# EAGLE design WemosD1MiniShield (EAGLE 9.1.3)
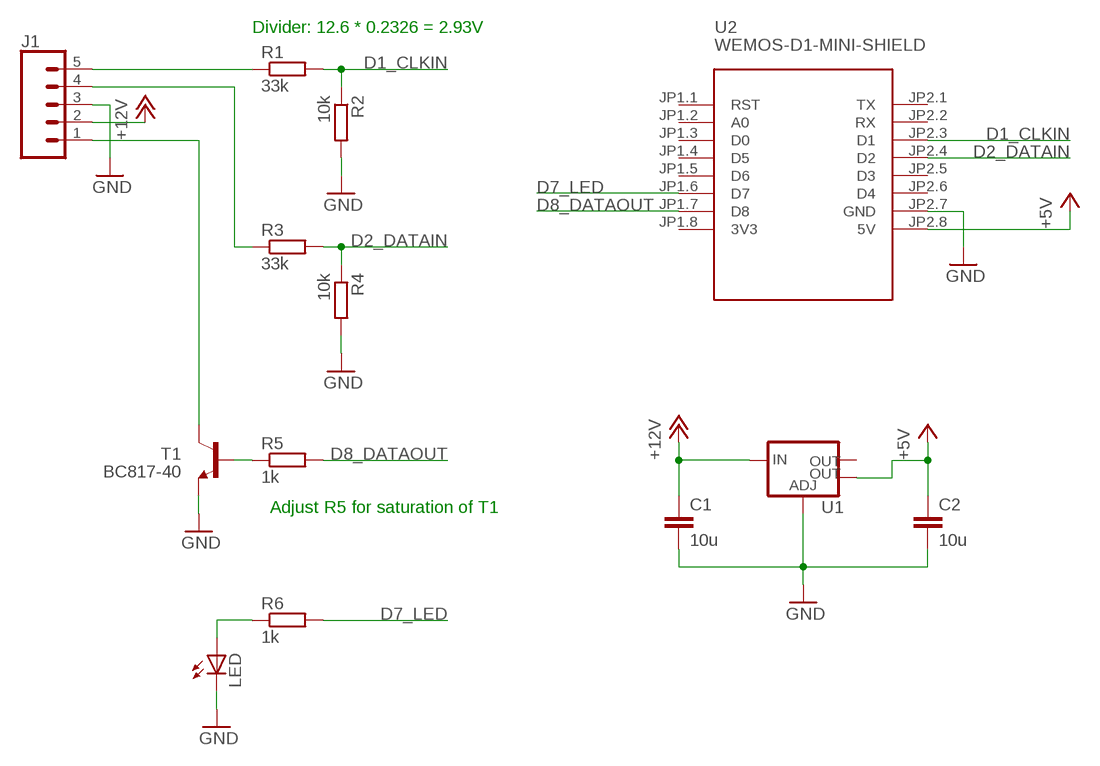
[diagram p0: schematic, sheet 1]

## Parts
C1  10u  C-EUC0805  [C0805]
C2  10u  C-EUC0805  [C0805]
J1  CONN_05LOCK  [1X05_LOCK]
LED  LED1206  [LED-1206]
R1  33k  R-EU_R0805  [R0805]
R2  10k  R-EU_R0805  [R0805]
R3  33k  R-EU_R0805  [R0805]
R4  10k  R-EU_R0805  [R0805]
R5  1k  R-EU_R0805  [R0805]
R6  1k  R-EU_R0805  [R0805]
T1  BC817-40  BC817-40-NPN-SOT23-BEC  [SOT23-BEC]
U1  V_REG_LM1117SOT223  [SOT223]
U2  WEMOS-D1-MINI-SHIELD  [WEMOS-D1-MINI-SHIELD]

## Nets
+5V: C2.1 U1.4(OUT) U2.JP2.8(5V)
+12V: C1.1 J1.2 U1.3(IN)
D1_CLKIN: R1.2 R2.1 U2.JP2.3(D1)
D2_DATAIN: R3.2 R4.1 U2.JP2.4(D2)
D7_LED: R6.2 U2.JP1.6(D7)
D8_DATAOUT: R5.2 U2.JP1.7(D8)
GND: C1.2 C2.2 J1.3 LED.C R2.2 R4.2 T1.E U1.1(ADJ) U2.JP2.7(GND)
N$1: J1.5 R1.1
N$2: J1.4 R3.1
N$3: J1.1 T1.C
N$4: R5.1 T1.B
N$5: LED.A R6.1
Unconnected: U1.2(OUT) U2.JP1.1(RST) U2.JP1.2(A0) U2.JP1.3(D0) U2.JP1.4(D5) U2.JP1.5(D6) U2.JP2.1(TX) U2.JP2.2(RX) U2.JP2.5(D3) U2.JP2.6(D4)

## Notes on the sheet
- Divider: 12.6 * 0.2326 = 2.93V
- Adjust R5 for saturation of T1

## Power pins joined to a net without a drawn wire
3V3: U2.JP1.8(3V3)

## Library data of the parts
C1 C2 = rcl:C-EU: CAPACITOR, European symbol; SPICEPREFIX: C
J1 = SparkFun-Connectors:CONN_05: Multi connection point. Often used as Generic Header-pin footprint for 0.1 inch spaced/style header connections On any of the 0.1 inch spaced packages, you can populate with these: Break Away Headers - Straight <https://www.sparkfun.com/products/116> (PRT-00116) Break Away Male Headers - Right Angle <https://www.sparkfun.com/products/553> (PRT-00553) Female Headers <https://www.sparkfun.com/products/115> (PRT-00115) Break Away Headers - Machine Pin <https://www.sparkfun.com/products/117> (PRT-00117) Break Away Female Headers - Swiss Machine Pin <https://www.sparkfun.com/products/743> (PRT-00743) For SCREWTERMINALS and SPRING TERMINALS visit here: Screw Terimnals on SparkFun.com <https://www.sparkfun.com/search/results?term=Screw+Terminals> (5mm/3.5mm/2.54mm spacing) This device is also useful as a general connection point to wire up your design to another part of your project. Our various solder wires solder well into these plated through hole pads. Hook-Up Wire - Assortment (Stranded, 22 AWG) <https://www.sparkfun.com/products/11375> (PRT-11375) Hook-Up Wire - Assortment (Solid Core, 22 AWG) <https://www.sparkfun.com/products/11367> (PRT-11367) View the entire wire category on our website here <https://www.sparkfun.com/categories/141> Special notes: Molex polarized connector foot print use with SKU : PRT-08231 with associated crimp pins and housings. 1MM SMD Version SKU: PRT-10208
LED = SparkFun:LED: LEDs Standard schematic elements and footprints for 5mm, 3mm, 1206, and 0603 sized LEDs. 5mm - Spark Fun Electronics SKU : COM-00529 (and others)
R1-R6 = rcl:R-EU_: RESISTOR, European symbol; SPICEPREFIX: R
T1 = transistor:*-NPN-: NPN Transistror BF959 corrected 2008.03.06
U1 = SparkFun-IC-Power:V_REG_LM1117: Voltage Regulator LM1117 Standard adjustable voltage regulator but in SMD form. Spark Fun Electronics SKU : COM-00595; PROD_ID: VREG-08170
U2 = diy-modules:WEMOS-D1-MINI-SHIELD: Template for WEMOS D1 mini compatible shields NOTICE: This is a template only. You can use it as a base to create symbols for WEMOS D1 mini compatible shields. Official list of available shields can be found here: https://www.wemos.cc/D1-mini-Shields

## Board
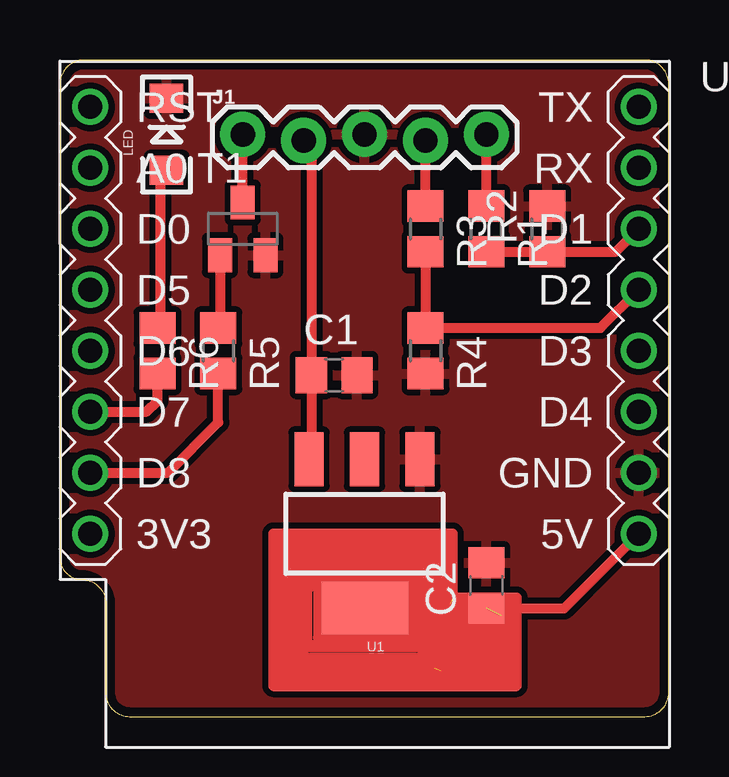
[diagram p1: board, top side]

Size 25.38 x 27.36 mm. Coordinates in mm from the lower left corner, seen from the top.
Outline: 25.38,1 25.38,26.36 arc90 24.38,27.36 1,27.36 arc90 0,26.36 0,6.62 arc90 0.91,5.71 arc-90 1.91,4.71 1.91,1 arc90 2.9,0 24.38,0 arc90 25.38,1
Copper layers (1*16): Top 0.035mm / dielectric 1.6mm / Bottom 0.035mm
Design rules "Elecrow_2-layer_PCB_eagle_rule *": minimum track width 6mil, minimum drill 12mil, track to track 10mil, track to pad 10mil, pad to pad 10mil, via to via 10mil, smd to smd 0mil, copper to edge 15mil, drill to drill 10mil, minimum pad ring 6mil, minimum via ring 6mil, stop-mask expansion 0mil, vias tented up to drill 100mil, thermal gap 10mil

### Footprints (pad centres in the part's own frame; a part is rotated, then mirrored left to right if it is on the bottom)
C0805 = smd 1.3 x 1.5: 1 -0.95,0; 2 0.95,0
1X05_LOCK = drill 1.016 pad 1.88: 1 0,0.127; 2 2.54,-0.127; 3 5.08,0.127; 4 7.62,-0.127; 5 10.16,0.127
LED-1206 = smd 1.2 x 1.4: A -1.5,0; C 1.5,0
R0805 = smd 1.3 x 1.5: 1 -0.95,0; 2 0.95,0
SOT23-BEC = smd 1 x 1.4: B -0.95,-1.1; C 0,1.1; E 0.95,-1.1
SOT223 = smd 1.219 x 2.235: 1 -2.311,-3.099; 2 0,-3.099; 3 2.311,-3.099 | smd 3.6 x 2.2: 4 0,3.099
WEMOS-D1-MINI-SHIELD = drill 1: JP1.1 -11.43,12.065; JP1.2 -11.43,9.525; JP1.3 -11.43,6.985; JP1.4 -11.43,4.445; JP1.5 -11.43,1.905; JP1.6 -11.43,-0.635; JP1.7 -11.43,-3.175; JP1.8 -11.43,-5.715; JP2.1 11.43,12.065; JP2.2 11.43,9.525; JP2.3 11.43,6.985; JP2.4 11.43,4.445; JP2.5 11.43,1.905; JP2.6 11.43,-0.635; JP2.7 11.43,-3.175; JP2.8 11.43,-5.715

### Placement (x,y rotation side)
C1  11.43,14.22 0 top
C2  17.78,5.46 90 top
J1  7.62,24.13 0 top
LED  4.45,24.26 90 top
R1  17.78,20.32 270 top
R2  20.32,20.32 90 top
R3  15.24,20.32 270 top
R4  15.24,15.24 270 top
R5  6.6,15.24 270 top
R6  4.06,15.24 270 top
T1  7.62,20.32 0 top
U1  12.7,7.62 180 top
U2  12.7,13.34 0 top

### Tracks (layer width: path | path; a pad name or v marks a point on that pad's centre or on a via)
+5V  (3 unrouted)
  Top 0.406: U1.4 17.78,4.52 C2.1 21.02,4.51 U2.JP2.8 | 8.89,7.62 8.89,1.27 19.05,1.27 19.05,4.95 16.38,4.95 16.38,7.62 8.89,7.62
  Top 0.508: 9.53,6.73 9.53,6.6 15.62,6.6 15.62,2.03 9.65,2.03 9.65,6.22 15.24,6.22 15.24,2.41 10.03,2.41 10.03,5.84 14.99,5.84 14.99,2.92 10.29,2.92 10.29,5.46 10.92,5.46 10.79,5.46 10.79,3.3 14.61,3.3 14.61,5.46 14.48,5.46 | 9.14,7.37 16.13,7.37 16.26,7.37 16.26,4.7 18.8,4.7 18.8,1.65 9.27,1.65 9.27,6.99 15.88,6.99 15.88,1.9 18.41,1.9 18.41,4.19 16.26,4.19 16.26,2.29 18.03,2.29 18.03,3.81 18.16,3.81 16.64,3.81 16.64,2.67 17.65,2.67 17.65,3.43 16.89,3.43 17.02,3.43 17.02,2.92 17.4,2.92 17.4,3.05
+12V
  Top 0.406: J1.2 10.48,23.68 C1.1 10.48,10.81 U1.3
D1_CLKIN
  Top 0.406: R1.2 R2.1 23.18,19.37 U2.JP2.3
D2_DATAIN
  Top 0.406: R3.2 R4.1 22.54,16.19 U2.JP2.4
D7_LED
  Top 0.406: U2.JP1.6 3.62,12.7 4.06,13.15 R6.2
D8_DATAOUT
  Top 0.406: U2.JP1.7 4.51,10.16 6.6,12.26 R5.2
GND
  Top 0.406: 12.7,24.38 J1.3
  pour Top: 0,27.3 25.53,27.3 25.53,0 -0.13,0 -0.13,27.3
N$1
  Top 0.406: R1.1 J1.5
N$2
  Top 0.406: R3.1 J1.4
N$3
  Top 0.406: T1.C J1.1
N$4
  Top 0.406: 6.92,16.51 R5.1 6.67,16.26 T1.B
N$5
  Top 0.406: R6.1 4.19,16.32 4.19,22.5 LED.A

### Text on the board
tStop: OUT | 12V | GND | DAT | CLK | CLK: D1 / DAT: D2 / OUT: D8 / LED: D7